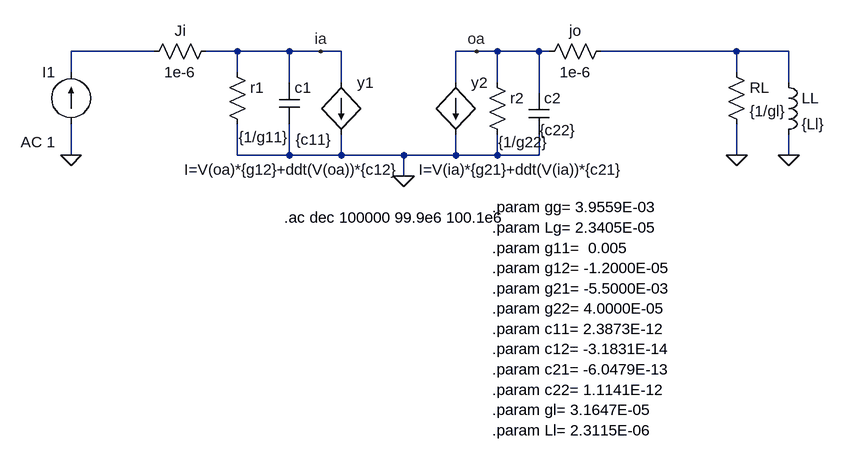
[diagram p0: schematic 2N3819_CG_100MHz_MTE_salida.asc]
2N3819_CG_100MHz_MTE_salida.asc, the LTspice schematic file:
Version 4
SHEET 1 880 748
WIRE -768 128 -896 128
WIRE -640 128 -688 128
WIRE -560 128 -640 128
WIRE -512 128 -560 128
WIRE -480 128 -512 128
WIRE -272 128 -304 128
WIRE -240 128 -272 128
WIRE -176 128 -240 128
WIRE -160 128 -176 128
WIRE 128 128 -80 128
WIRE 208 128 128 128
WIRE -896 160 -896 128
WIRE -640 160 -640 128
WIRE 128 160 128 128
WIRE -560 176 -560 128
WIRE -480 176 -480 128
WIRE -304 176 -304 128
WIRE -240 176 -240 128
WIRE 208 176 208 128
WIRE -176 192 -176 128
WIRE -896 288 -896 240
WIRE -640 288 -640 240
WIRE -560 288 -560 240
WIRE -560 288 -640 288
WIRE -480 288 -480 256
WIRE -480 288 -560 288
WIRE -384 288 -480 288
WIRE -304 288 -304 256
WIRE -304 288 -384 288
WIRE -240 288 -240 256
WIRE -240 288 -304 288
WIRE -176 288 -176 256
WIRE -176 288 -240 288
WIRE 128 288 128 240
WIRE 208 288 208 256
WIRE -384 320 -384 288
FLAG -896 288 0
FLAG -512 128 ia
FLAG -272 128 oa
FLAG -384 320 0
FLAG 128 288 0
FLAG 208 288 0
SYMBOL res -656 144 R0
WINDOW 3 18 116 Left 2
SYMATTR Value {1/g11}
SYMATTR InstName r1
SYMBOL cap -576 176 R0
WINDOW 3 26 88 Left 2
SYMATTR Value {c11}
SYMATTR InstName c1
SYMBOL res -256 160 R0
WINDOW 3 17 108 Left 2
SYMATTR Value {1/g22}
SYMATTR InstName r2
SYMBOL cap -192 192 R0
WINDOW 3 17 57 Left 2
SYMATTR Value {c22}
SYMATTR InstName c2
SYMATTR SpiceLine Rser=0
SYMBOL bi -480 176 R0
WINDOW 3 -242 134 Left 2
SYMATTR Value I=V(oa)*{g12}+ddt(V(oa))*{c12}
SYMATTR InstName y1
SYMBOL bi -304 176 R0
WINDOW 3 -57 134 Left 2
SYMATTR Value I=V(ia)*{g21}+ddt(V(ia))*{c21}
SYMATTR InstName y2
SYMBOL res -64 112 R90
WINDOW 0 0 56 VBottom 2
WINDOW 3 32 56 VTop 2
SYMATTR InstName jo
SYMATTR Value 1e-6
SYMBOL res -784 144 R270
WINDOW 0 32 56 VTop 2
WINDOW 3 0 56 VBottom 2
SYMATTR InstName Ji
SYMATTR Value 1e-6
SYMBOL current -896 240 R180
WINDOW 0 24 80 Left 2
WINDOW 3 24 0 Left 2
WINDOW 123 24 -28 Left 2
WINDOW 39 0 0 Left 2
SYMATTR InstName I1
SYMATTR Value ""
SYMATTR Value2 AC 1
SYMBOL res 112 144 R0
SYMATTR InstName RL
SYMATTR Value {1/gl}
SYMBOL ind 192 160 R0
SYMATTR InstName LL
SYMATTR Value {Ll}
TEXT -248 368 Left 2 !.param gg= 3.9559E-03\n.param Lg= 2.3405E-05\n.param g11=  0.005\n.param g12= -1.2000E-05\n.param g21= -5.5000E-03\n.param g22= 4.0000E-05\n.param c11= 2.3873E-12\n.param c12= -3.1831E-14\n.param c21= -6.0479E-13\n.param c22= 1.1141E-12\n.param gl= 3.1647E-05\n.param Ll= 2.3115E-06
TEXT -568 384 Left 2 !.ac dec 100000 99.9e6 100.1e6

The netlist it stands for:
* 2N3819_CG_100MHz_MTE_salida.asc
r1 ia 0 {1/g11}
c1 ia 0 {c11}
r2 oa 0 {1/g22}
c2 oa 0 {c22} Rser=0
B§y1 ia 0 I=V(oa)*{g12}+ddt(V(oa))*{c12}
B§y2 oa 0 I=V(ia)*{g21}+ddt(V(ia))*{c21}
R§jo N002 oa 1e-6
R§Ji N001 ia 1e-6
I1 0 N001 AC 1
RL N002 0 {1/gl}
LL N002 0 {Ll}
.param gg= 3.9559E-03
.param Lg= 2.3405E-05
.param g11=  0.005
.param g12= -1.2000E-05
.param g21= -5.5000E-03
.param g22= 4.0000E-05
.param c11= 2.3873E-12
.param c12= -3.1831E-14
.param c21= -6.0479E-13
.param c22= 1.1141E-12
.param gl= 3.1647E-05
.param Ll= 2.3115E-06
.ac dec 100000 99.9e6 100.1e6
.backanno
.end